# Altium project ds3231.PrjPCB
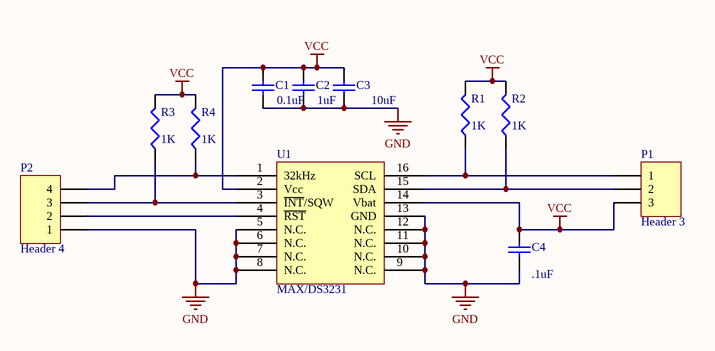
[diagram p0: ds3231.SchDoc]
1 sheet, 11 parts. Net scope: global (net labels, ports and power ports of the same name join across sheets).
Board file: ds3231.PcbDoc

## Sheet ds3231.SchDoc
size A

### Parts
C1  value 0.1uF  [CC1608-0603]  (hidden comment: Cap)
C2  value 1uF  [CC1608-0603]  (hidden comment: Cap)
C3  value 10uF  [CC1608-0603]  (hidden comment: Cap)
C4  value .1uF  [CC1608-0603]  (hidden comment: Cap)
P1  Header 3  [HDR1X3]
P2  Header 4  [HDR1X4]
R1  value 1K  [CR1608-0603]  (hidden comment: Res3)
R2  value 1K  [CR1608-0603]  (hidden comment: Res3)
R3  value 1K  [CR1608-0603]  (hidden comment: Res3)
R4  value 1K  [CR1608-0603]  (hidden comment: Res3)
U1  MAX/DS3231  [SOIC16 - DS3231]

### Nets
GND: C1.1 C2.1 C3.1 C4.1 P2.1 U1.5(N.C.) U1.6(N.C.) U1.7(N.C.) U1.8(N.C.) U1.9(N.C.) U1.10(N.C.) U1.11(N.C.) U1.12(N.C.) U1.13(GND)
VCC: C1.2 C2.2 C3.2 C4.2 P1.3 R1.2 R2.2 R3.2 R4.2 U1.2(Vcc) U1.14(Vbat)
NetP1_1: P1.1 R1.1 U1.16(SCL)
NetP1_2: P1.2 R2.1 U1.15(SDA)
NetP2_2: P2.2 U1.4(~{RST})
NetP2_3: P2.3 R3.1 U1.3(~{INT}/SQW)
NetP2_4: P2.4 R4.1 U1.1(32kHz)

### Library data of the parts
C1-C4 = Cap: Capacitor; Published: 8-Jun-2000; LatestRevisionDate: 17-Jul-2002; LatestRevisionNote: Re-released for DXP Platform.; PackageReference: RAD-0.3; Publisher: Altium Limited
P1 = Header 3: Header, 3-Pin; LatestRevisionDate: 17-Jul-2002; LatestRevisionNote: Re-released for DXP Platform.; Publisher: Altium Limited
P2 = Header 4: Header, 4-Pin; LatestRevisionDate: 17-Jul-2002; LatestRevisionNote: Re-released for DXP Platform.; Publisher: Altium Limited
R1-R4 = Res3: Resistor; Published: 8-Jun-2000; LatestRevisionDate: 04-Mar-2005; LatestRevisionNote: PCB Footprint replaced.; PackageReference: J1-0603; Publisher: Altium Limited
U1 = MAX/DS3231: MAX DS3231